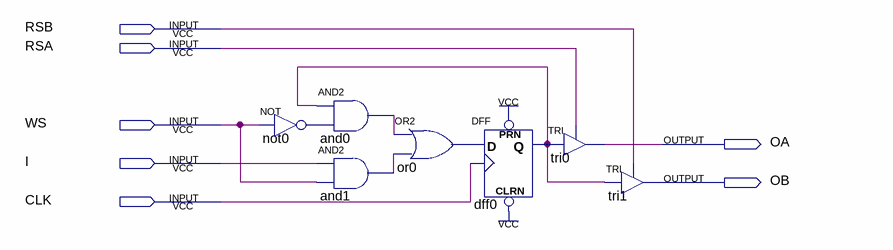
[diagram p0: schematic sheet]
// Quartus schematic RFC.bdf as structural Verilog: 7 symbols, 7 pins
module RFC (
  input  RSB,
  input  RSA,
  input  WS,
  input  I,
  input  CLK,
  output OA,
  output OB
);

  wire and0_out, and1_out, dff0_q, not0_out, or0_out;

  not not0 (not0_out, WS);
  and and0 (and0_out, dff0_q, not0_out);
  and and1 (and1_out, I, WS);
  or or0 (or0_out, and0_out, and1_out);
  DFF dff0 (.CLRN(1'b1), .CLK(CLK), .D(or0_out), .PRN(1'b1), .Q(dff0_q));
  TRI \tri0  (.IN(dff0_q), .OE(RSA), .OUT(OA));
  TRI \tri1  (.IN(dff0_q), .OE(RSB), .OUT(OB));
endmodule
